# Altium schematic sheet Power.SchDoc
size A; SheetNumber: 2; SheetTotal: 5
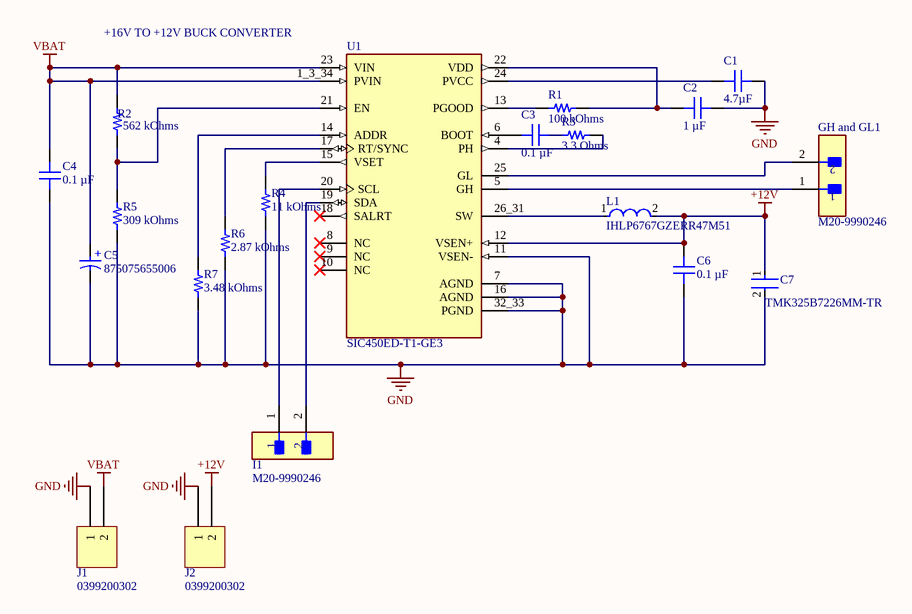
[diagram p0: Power.SchDoc]

## Parts
C1  4.7µF  [CAP 0603_1608]
C2  1 µF  [CAP 0603_1608]
C3  0.1 µF  [CAP 0402_1005]
C4  0.1 µF  [CAP 0402_1005]
C5  875075655006  [WCAP-PSLC_D8H11.7]
C6  0.1 µF  [CAP 0402_1005]
C7  TMK325B7226MM-TR  [FP-1210-L_3_2_0_3-W_2_5_0-MFG]
GH_and_GL1  M20-9990246  [FP-M20-9990246-MFG]
I1  M20-9990246  [FP-M20-9990246-MFG]
J1  0399200302  [MOLEX 0399200302]
J2  0399200302  [MOLEX 0399200302]
L1  IHLP6767GZERR47M51  [FP-IHLP-6767GZ-FP_3_825x1-MFG]
R1  100 kOhms  [RES 0402_1005]
R2  562 kOhms  [RES 0603_1608]
R3  3.3 Ohms  [RES 0402_1005]
R4  11 kOhms  [RES 0603_1608]
R5  309 kOhms  [RES 0603_1608]
R6  2.87 kOhms  [RES 0603_1608]
R7  3.48 kOhms  [RES 0603_1608]
U1  SIC450ED-T1-GE3  [VREG_SIC450ED-T1-GE3]

## Nets
+12V: C6.2 C7.1 J2.2 L1.2 U1.12(VSEN+)
GND: C1.1 C2.1 C4.1 C5.2(N) C6.1 C7.2 J1.1 J2.1 R4.1 R5.1 R6.1 R7.1 U1.7(AGND) U1.11(VSEN-) U1.16(AGND) U1.32_33(PGND)
VBAT: C4.2 C5.1(P) J1.2 R2.2 U1.1_3_34(PVIN) U1.23(VIN)
NetC1_2: C1.2 U1.24(PVCC)
NetC2_2: C2.2 R1.1 U1.22(VDD)
NetC3_1: C3.1 U1.6(BOOT)
NetC3_2: C3.2 R3.1
NetGH_and_GL1_1: GH_and_GL1.1 U1.5(GH)
NetGH_and_GL1_2: GH_and_GL1.2 U1.25(GL)
NetI1_1: I1.1 U1.20(SCL)
NetI1_2: I1.2 U1.19(SDA)
NetL1_1: L1.1 U1.26_31(SW)
NetR1_2: R1.2 U1.13(PGOOD)
NetR2_1: R2.1 R5.2 U1.21(EN)
NetR3_2: R3.2 U1.4(PH)
NetR4_2: R4.2 U1.15(VSET)
NetR6_2: R6.2 U1.17(RT/SYNC)
NetR7_2: R7.2 U1.14(ADDR)

Not connected (* = marked no-connect by the designer): U1 8(NC)* 9(NC)* 10(NC)* 18(SALRT)*

## Notes on the sheet
- +16V TO +12V BUCK CONVERTER
- (in symbol CMP-03913-90235614-1) +

## Library data of the parts
C1 = 06036D475KAT4A: CAP CER 4.7UF 6.3V X5R 0603; manufacturer: AVX Corporation; Tolerance: ±10%; Part Number: 06036D475KAT4A; Value: 4.7µF; Applications: General Purpose; Capacitance: 4.7µF; componentlink1description: Datasheet; componentlink1url: http://datasheets.avx.com/cx5r.pdf; componentlink2description: DigiKey Link; componentlink2url: http://digikey.com/product-detail/en/avx-corporation/06036D475KAT4A/478-10813-1-ND/7536337; Device Package: 0603 (1608 Metric); lastupdated: 2020-09-02 1:03:34 AM; Lifecycle Status: Active; Minimum Order: 1; Mounting Type: Surface Mount, MLCC; Operating Temperature: -55°C ~ 85°C; Package / Case: 0603 (1608 Metric); packaging: TapeAndReel; partid: 2929; Part Status: Active; price: 0.02; series: -; Size / Dimension: 0.063" L x 0.032" W (1.60mm x 0.81mm); Supplier 1: DigiKey; Supplier Part Number 1: 478-10813-1-ND; Temperature Coefficient: X5R; Thickness (Max): 0.037" (0.94mm); Voltage - Rated: 6.3V
C2 = C0603X105M9RACAUTO: CAP CER 1UF 6.3V X7R 0603; manufacturer: KEMET; Tolerance: ±20%; Part Number: C0603X105M9RACAUTO; Value: 1 µF; Applications: Automotive, Boardflex Sensitive; Capacitance: 1 µF; componentlink1description: Datasheet; componentlink1url: https://api.kemet.com/component-edge/download/datasheet/C0603X105M9RACAUTO.pdf; componentlink2description: DigiKey Link; componentlink2url: https://www.digikey.com/en/products/detail/kemet/C0603X105M9RACAUTO/8635848; Device Package: 0603 (1608 Metric); Features: Soft Termination; lastupdated: 2024-01-28 8:09:58 PM; Lifecycle Status: Active; Minimum Order: 1; Mounting Type: Surface Mount, MLCC; Operating Temperature: -55°C ~ 125°C; Package / Case: 0603 (1608 Metric); packaging: TapeAndReel; partid: 2401; Part Status: Active; price: 0.06; Ratings: AEC-Q200; series: SMD Auto X7R Flex; Size / Dimension: 0.063" L x 0.031" W (1.60mm x 0.80mm); Supplier 1: DigiKey; Supplier Part Number 1: 399-17721-1-ND; Temperature Coefficient: X7R; Thickness (Max): 0.037" (0.95mm); Voltage - Rated: 6.3V
C3 = CL05B104KP5VPNC: CAP CER 100NF 10V X7R 0402; manufacturer: Samsung Electro-Mechanics; Tolerance: ±10%; Part Number: CL05B104KP5VPNC; Value: 0.1 µF; Applications: Automotive; Capacitance: 0.1 µF; componentlink1description: Datasheet; componentlink1url: https://mm.digikey.com/Volume0/opasdata/d220001/medias/docus/5458/CL05B104KP5VPNC_Spec.pdf; componentlink2description: DigiKey Link; componentlink2url: https://www.digikey.com/en/products/detail/samsung-electro-mechanics/CL05B104KP5VPNC/20498482; Device Package: 0402 (1005 Metric); lastupdated: 2024-01-28 8:02:59 PM; Lifecycle Status: Active; Minimum Order: 1; Mounting Type: Surface Mount, MLCC; Operating Temperature: -55°C ~ 125°C; Package / Case: 0402 (1005 Metric); packaging: TapeAndReel; partid: 56690; price: 0.01; Ratings: AEC-Q200; series: CL; Size / Dimension: 0.039" L x 0.020" W (1.00mm x 0.50mm); Supplier 1: DigiKey; Supplier Part Number 1: 1276-CL05B104KP5VPNCCT-ND; Temperature Coefficient: X7R; Thickness (Max): 0.022" (0.55mm); Voltage - Rated: 10V
C4 C6 = GCM155R71E104KE02D: CAP CER 0.1UF 25V X7R 0402; manufacturer: Murata Electronics; Tolerance: ±10%; Part Number: GCM155R71E104KE02D; Value: 0.1 µF; Applications: Automotive; Capacitance: 0.1 µF; componentlink1description: Datasheet; componentlink1url: https://search.murata.co.jp/Ceramy/image/img/A01X/G101/ENG/GCM155R71E104KE02-01.pdf; componentlink2description: DigiKey Link; componentlink2url: https://www.digikey.com/en/products/detail/murata-electronics/GCM155R71E104KE02D/7363175; Device Package: 0402 (1005 Metric); Lifecycle Status: Active; Minimum Order: 1; Mounting Type: Surface Mount, MLCC; Operating Temperature: -55°C ~ 125°C; Package / Case: 0402 (1005 Metric); packaging: TapeAndReel; partid: 2051; Part Status: Active; price: 0.01; Ratings: AEC-Q200; series: GCM; Size / Dimension: 0.039" L x 0.020" W (1.00mm x 0.50mm); Supplier 1: DigiKey; Supplier Part Number 1: 490-16431-1-ND; Temperature Coefficient: X7R; Thickness (Max): 0.022" (0.55mm); Voltage - Rated: 25V
  C4: lastupdated: 2024-02-09 8:04:37 PM
  C6: lastupdated: 2024-01-28 8:04:19 PM
C5 = CMP-03913-90235614-1: 875075655006 Cap, 150Uf, 35V, Alu Elec Smd, Polymer Rohs Compliant: Yes; Leakage Current: 840µA; ESR (Equivalent Series Resistance): 25mΩ; Capacitance: 150µF; Ripple Current: 3.8A; Width: 8.3mm; Min Operating Temperature: -55°C; Voltage Rating: 35V; Diameter: 8mm; Length: 11.7mm; RoHS: Compliant; NexarPartId: 90235614; Max Operating Temperature: 105°C
C7 = CMP-14477-000122-1: CAP CER 22UF 25V X7R 1210; Tolerance: 20%; Length: 3.2mm; Packaging: Tape and Reel; REACH SVHC: No SVHC; Case Code (Imperial): 1210; Mount: Surface Mount; Depth: 2.5mm; Resistor Type: Ceramic; Thickness: 0.106inch; Lead Free: Lead Free; Construction: Flat; Min Operating Temperature: -55°C; Voltage: 25V; Voltage Rating: 25V; Capacitance: 22uF; Radiation Hardening: No; Halogen Free: Halogen Free; Max Operating Temperature: 125°C; Case/Package: 1210; Case Code (Metric): 3225; Height: 2.5mm; Width: 0.098inch; Series: M; Package Quantity: 500; RoHS Compliant: Yes; Dielectric: X7R; Termination: SMD/SMT; Number of Pins: 2; Voltage Rating (DC): 25V
GH_and_GL1 I1 = CMP-15831-000009-1: CONN HEADER VERT 2POS 2.54MM; Manufacturer: Harwin; Conn Gender: Male; Conn Orientation: Vertical; Number Of Contacts: 2; Current Rating: 3A; ComponentLink2URL: https://cdn.harwin.com/pdfs/M20-999.pdf; ComponentLink2Description: Datasheet; Package: M20-9990246; Temperature: -40°C to +105°C; Octopart: https://octopart.com/m20-9990246-harwin-2590635; Mouser Description: 2.54mm (0.1") Pitch SIL Vertical PC Tail Pin Header, 6.1mm mating pin height, tin, 2 contacts; Temperature Range High: +105°C; Device Class L1: Connectors; RoHS: TRUE; Automotive: No; Height: 8.99mm; Number Of Rows: 1; Contact Material: Tin,Nickel; Category: Conn; Pitch: 2.54mm; Lead Free: Yes; Digikey Description: CONN HEADER VERT 2POS 2.54MM; Manufacturer Part Number: M20-9990246; Temperature Range Low: -40°C; Device Class L3: unset; Device Class L2: Headers and Wire Housings
J1 J2 = 0399200302: TERM BLK 2P SIDE ENTRY 15MM PCB; Manufacturer: Molex; Current: 115 A; Mating Orientation: Horizontal with Board; Number of Levels: 1; Pitch: 0.591" (15.00mm); Positions Per Level: 2; Voltage: 600 V; Wire Gauge: 1-8 AWG; Wire Termination: Screw - Rising Cage Clamp; Part Number: 0399200302; Color: Black; ComponentLink1Description: Datasheet; ComponentLink1URL: https://www.molex.com/pdm_docs/sd/399200302_sd.pdf; ComponentLink2Description: DigiKey Link; ComponentLink2URL: https://www.digikey.com/en/products/detail/molex/0399200302/3316297; LastUpdated: 2022-03-05 4:30:55 PM; Lifecycle Status: Active; Minimum Order: 1; Mounting Type: Through Hole; Packaging: Bulk; Part Status: Active; Price: 5.90; Series: Eurostyle 39920; Supplier 1: DigiKey; Supplier Part Number 1: WM20114-ND
L1 = CMP-02424-000445-1: Commercial Inductors, High Temperature (155 °C) Series 0.47uH 65A 0.95mΩ 20%; Max DC Current: 63A; DC Resistance (DCR): 0.95mR; Saturation Current: 76A; Resistance: 950R; Self Resonant Frequency: 52.3MHz; Inductance: 470nH; Test Frequency: 100kHz; Shielding: Shielded; Max Operating Temperature: 155°C; Height: 7mm; Case/Package: 6767; Termination: SMD/SMT; Width: 17.15mm; Package Quantity: 200; Length: 0.675inch; Tolerance: 20%; Inductance Tolerance: 20%; Depth: 17.5mm; Radiation Hardening: No; Height - Seated (Max): 0.276inch; RMS Current (Irms): 63A; Mount: Surface Mount; Current Rating: 65A; Lead Free: Lead Free; Weight: 0.417996oz; Packaging: Tape and Reel; Min Operating Temperature: -55°C
R1 = RT0402FRE07100KL: RES SMD 100K OHM 1% 1/16W 0402; Manufacturer: Yageo; Power (Watts): 0.063W, 1/16W; Temperature Coefficient: ±50ppm/°C; Part Number: RT0402FRE07100KL; Value: 100 kOhms; ComponentLink1Description: Datasheet; ComponentLink1URL: https://www.yageo.com/upload/media/product/productsearch/datasheet/rchip/PYu-RT_1-to-0.01_RoHS_L_11.pdf; ComponentLink2Description: DigiKey Link; ComponentLink2URL: https://www.digikey.com/en/products/detail/yageo/RT0402FRE07100KL/1071698; Composition: Thin Film; Device Package: 0402 (1005 Metric); Height - Seated (Max): 0.014" (0.35mm); LastUpdated: 2024-01-28 8:28:38 PM; Lifecycle Status: Active; Minimum Order: 1; Number of Terminations: 2; Operating Temperature: -55°C ~ 155°C; Package / Case: 0402 (1005 Metric); Packaging: TapeAndReel; PartId: 3190; Part Status: Active; Price: 0.01; Resistance: 100 kOhms; Series: RT; Size / Dimension: 0.039" L x 0.020" W (1.00mm x 0.50mm); Supplier 1: DigiKey; Supplier Part Number 1: YAG2307CT-ND; Supplier Device Package: 0402; Tolerance: ±1%
R2 = RK73H1JTTD5623F: RES 562K OHM 1% 1/10W 0603; Manufacturer: KOA Speer Electronics, Inc.; Power (Watts): 0.1W, 1/10W; Temperature Coefficient: ±100ppm/°C; Part Number: RK73H1JTTD5623F; Value: 562 kOhms; ComponentLink1Description: Datasheet; ComponentLink1URL: http://www.koaspeer.com/catimages/Products/RK73H/RK73H.pdf; ComponentLink2Description: DigiKey Link; ComponentLink2URL: https://www.digikey.com/en/products/detail/koa-speer-electronics-inc/RK73H1JTTD5623F/9845175; Composition: Thick Film; Device Package: 0603 (1608 Metric); Features: Automotive AEC-Q200, Moisture Resistant; Height - Seated (Max): 0.022" (0.55mm); LastUpdated: 2024-01-28 8:39:45 PM; Lifecycle Status: Active; Minimum Order: 1; Number of Terminations: 2; Operating Temperature: -55°C ~ 155°C; Package / Case: 0603 (1608 Metric); Packaging: CutTape; PartId: 8595; Part Status: Active; Price: 0.01; Ratings: AEC-Q200; Resistance: 562 kOhms; Series: RK73H; Size / Dimension: 0.063" L x 0.031" W (1.60mm x 0.80mm); Supplier 1: DigiKey; Supplier Part Number 1: 2019-RK73H1JTTD5623FCT-ND; Supplier Device Package: 0603; Tolerance: ±1%
R3 = ERJ-2GEJ3R3X: RES SMD 3.3 OHM 5% 1/10W 0402; Manufacturer: Panasonic Electronic Components; Power (Watts): 0.1W, 1/10W; Temperature Coefficient: -100/ +600ppm/°C; Part Number: ERJ-2GEJ3R3X; Value: 3.3 Ohms; ComponentLink1Description: Datasheet; ComponentLink1URL: https://b2b-api.panasonic.eu/file_stream/pids/fileversion/1242; ComponentLink2Description: DigiKey Link; ComponentLink2URL: https://www.digikey.com/en/products/detail/panasonic-electronic-components/ERJ-2GEJ3R3X/282082; Composition: Thick Film; Device Package: 0402 (1005 Metric); Features: Automotive AEC-Q200; Height - Seated (Max): 0.016" (0.40mm); LastUpdated: 2024-01-28 8:28:37 PM; Lifecycle Status: Active; Minimum Order: 1; Number of Terminations: 2; Operating Temperature: -55°C ~ 155°C; Package / Case: 0402 (1005 Metric); Packaging: CutTape; PartId: 3568; Part Status: Active; Price: 0.01; Ratings: AEC-Q200; Resistance: 3.3 Ohms; Series: ERJ-2G; Size / Dimension: 0.039" L x 0.020" W (1.00mm x 0.50mm); Supplier 1: DigiKey; Supplier Part Number 1: P3.3JCT-ND; Supplier Device Package: 0402; Tolerance: ±5%
R4 = TNPW060311K0BYEN: RES 11K OHM 0.1% 1/10W 0603; Manufacturer: Vishay Dale; Power (Watts): 0.1W, 1/10W; Temperature Coefficient: ±10ppm/°C; Part Number: TNPW060311K0BYEN; Value: 11 kOhms; ComponentLink1Description: Datasheet; ComponentLink1URL: http://www.vishay.com/docs/28758/tnpw_e3.pdf; ComponentLink2Description: DigiKey Link; ComponentLink2URL: https://www.digikey.com/en/products/detail/vishay-dale/TNPW060311K0BYEN/8636632; Composition: Thin Film; Device Package: 0603 (1608 Metric); Features: Anti-Sulfur, Automotive AEC-Q200, Moisture Resistant; Height - Seated (Max): 0.022" (0.55mm); LastUpdated: 2024-01-28 8:39:55 PM; Lifecycle Status: Active; Minimum Order: 1; Number of Terminations: 2; Operating Temperature: -55°C ~ 155°C; Package / Case: 0603 (1608 Metric); Packaging: TapeAndReel; PartId: 6393; Part Status: Active; Price: 0.25; Ratings: AEC-Q200; Resistance: 11 kOhms; Series: TNPW e3; Size / Dimension: 0.061" L x 0.033" W (1.55mm x 0.85mm); Supplier 1: DigiKey; Supplier Part Number 1: 541-9816-1-ND; Supplier Device Package: 0603; Tolerance: ±0.1%
R5 = RG1608P-3093-B-T5: RES SMD 309K OHM 0.1% 1/10W 0603; Manufacturer: Susumu; Power (Watts): 0.1W, 1/10W; Temperature Coefficient: ±25ppm/°C; Part Number: RG1608P-3093-B-T5; Value: 309 kOhms; ComponentLink1Description: Datasheet; ComponentLink1URL: //media.digikey.com/pdf/Data%20Sheets/Susumu%20PDFs/RG_RM_RGH_Oct2012.pdf; ComponentLink2Description: DigiKey Link; ComponentLink2URL: https://www.digikey.com/en/products/detail/susumu/RG1608P-3093-B-T5/1240553; Composition: Thin Film; Device Package: 0603 (1608 Metric); Features: Anti-Sulfur, Automotive AEC-Q200; Height - Seated (Max): 0.020" (0.50mm); LastUpdated: 2024-01-28 8:39:51 PM; Lifecycle Status: Active; Minimum Order: 1; Number of Terminations: 2; Operating Temperature: -55°C ~ 155°C; Package / Case: 0603 (1608 Metric); Packaging: TapeAndReel; PartId: 7313; Part Status: Active; Price: 0.05; Ratings: AEC-Q200; Resistance: 309 kOhms; Series: RG; Size / Dimension: 0.063" L x 0.031" W (1.60mm x 0.80mm); Supplier 1: DigiKey; Supplier Part Number 1: RG16P309KBCT-ND; Supplier Device Package: 0603; Tolerance: ±0.1%
R6 = RC0603FR-072K87L: RES 2.87K OHM 1% 1/10W 0603; Manufacturer: Yageo; Power (Watts): 0.1W, 1/10W; Temperature Coefficient: ±100ppm/°C; Part Number: RC0603FR-072K87L; Value: 2.87 kOhms; ComponentLink1Description: Datasheet; ComponentLink1URL: https://www.yageo.com/upload/media/product/productsearch/datasheet/rchip/PYu-RC_Group_51_RoHS_L_10.pdf; ComponentLink2Description: DigiKey Link; ComponentLink2URL: https://www.digikey.com/en/products/detail/yageo/RC0603FR-072K87L/727036; Composition: Thick Film; Device Package: 0603 (1608 Metric); Features: Moisture Resistant; Height - Seated (Max): 0.022" (0.55mm); LastUpdated: 2024-01-28 8:39:50 PM; Lifecycle Status: Active; Minimum Order: 1; Number of Terminations: 2; Operating Temperature: -55°C ~ 155°C; Package / Case: 0603 (1608 Metric); Packaging: CutTape; PartId: 7498; Part Status: Active; Price: 0.01; Resistance: 2.87 kOhms; Series: RC_L; Size / Dimension: 0.063" L x 0.031" W (1.60mm x 0.80mm); Supplier 1: DigiKey; Supplier Part Number 1: 311-2.87KHRCT-ND; Supplier Device Package: 0603; Tolerance: ±1%
R7 = RNCP0603FTD3K48: RES 3.48K OHM 1% 1/8W 0603; Manufacturer: Stackpole Electronics Inc; Power (Watts): 0.125W, 1/8W; Temperature Coefficient: ±100ppm/°C; Part Number: RNCP0603FTD3K48; Value: 3.48 kOhms; ComponentLink1Description: Datasheet; ComponentLink1URL: https://www.seielect.com/catalog/sei-rncp.pdf; ComponentLink2Description: DigiKey Link; ComponentLink2URL: https://www.digikey.com/en/products/detail/stackpole-electronics-inc/RNCP0603FTD3K48/2240122; Composition: Thin Film; Device Package: 0603 (1608 Metric); Features: Anti-Sulfur; Height - Seated (Max): 0.020" (0.50mm); LastUpdated: 2024-01-28 8:39:52 PM; Lifecycle Status: Active; Minimum Order: 1; Number of Terminations: 2; Operating Temperature: -55°C ~ 155°C; Package / Case: 0603 (1608 Metric); Packaging: TapeAndReel; PartId: 6983; Part Status: Active; Price: 0.01; Resistance: 3.48 kOhms; Series: RNCP; Size / Dimension: 0.059" L x 0.031" W (1.50mm x 0.80mm); Supplier 1: DigiKey; Supplier Part Number 1: RNCP0603FTD3K48CT-ND; Supplier Device Package: 0603; Tolerance: ±1%
U1 = CMP-351-000000-1: Buck Switching Regulator IC Positive Adjustable 0.3V 1 Output 40A 34-PowerWFQFN; MF: Vishay Siliconix; SnapEDA_Link: https://www.snapeda.com/parts/SIC450ED-T1-GE3/Vishay+Siliconix/view-part/?ref=snap; MP: SIC450ED-T1-GE3; Availability: In Stock; Source: SIC450ED-T1-GE3.SchLib; Purchase-URL: https://pricing.snapeda.com/search/part/SIC450ED-T1-GE3/?ref=eda; Price: None; Component Type: Standard; Value: *; Pin Count: 25; Package: PowerWFQFN-34 Vishay Siliconix; Design Item ID: SIC450ED-T1-GE3; Check_prices: https://www.snapeda.com/parts/SIC450ED-T1-GE3/Vishay+Siliconix/view-part/?ref=eda